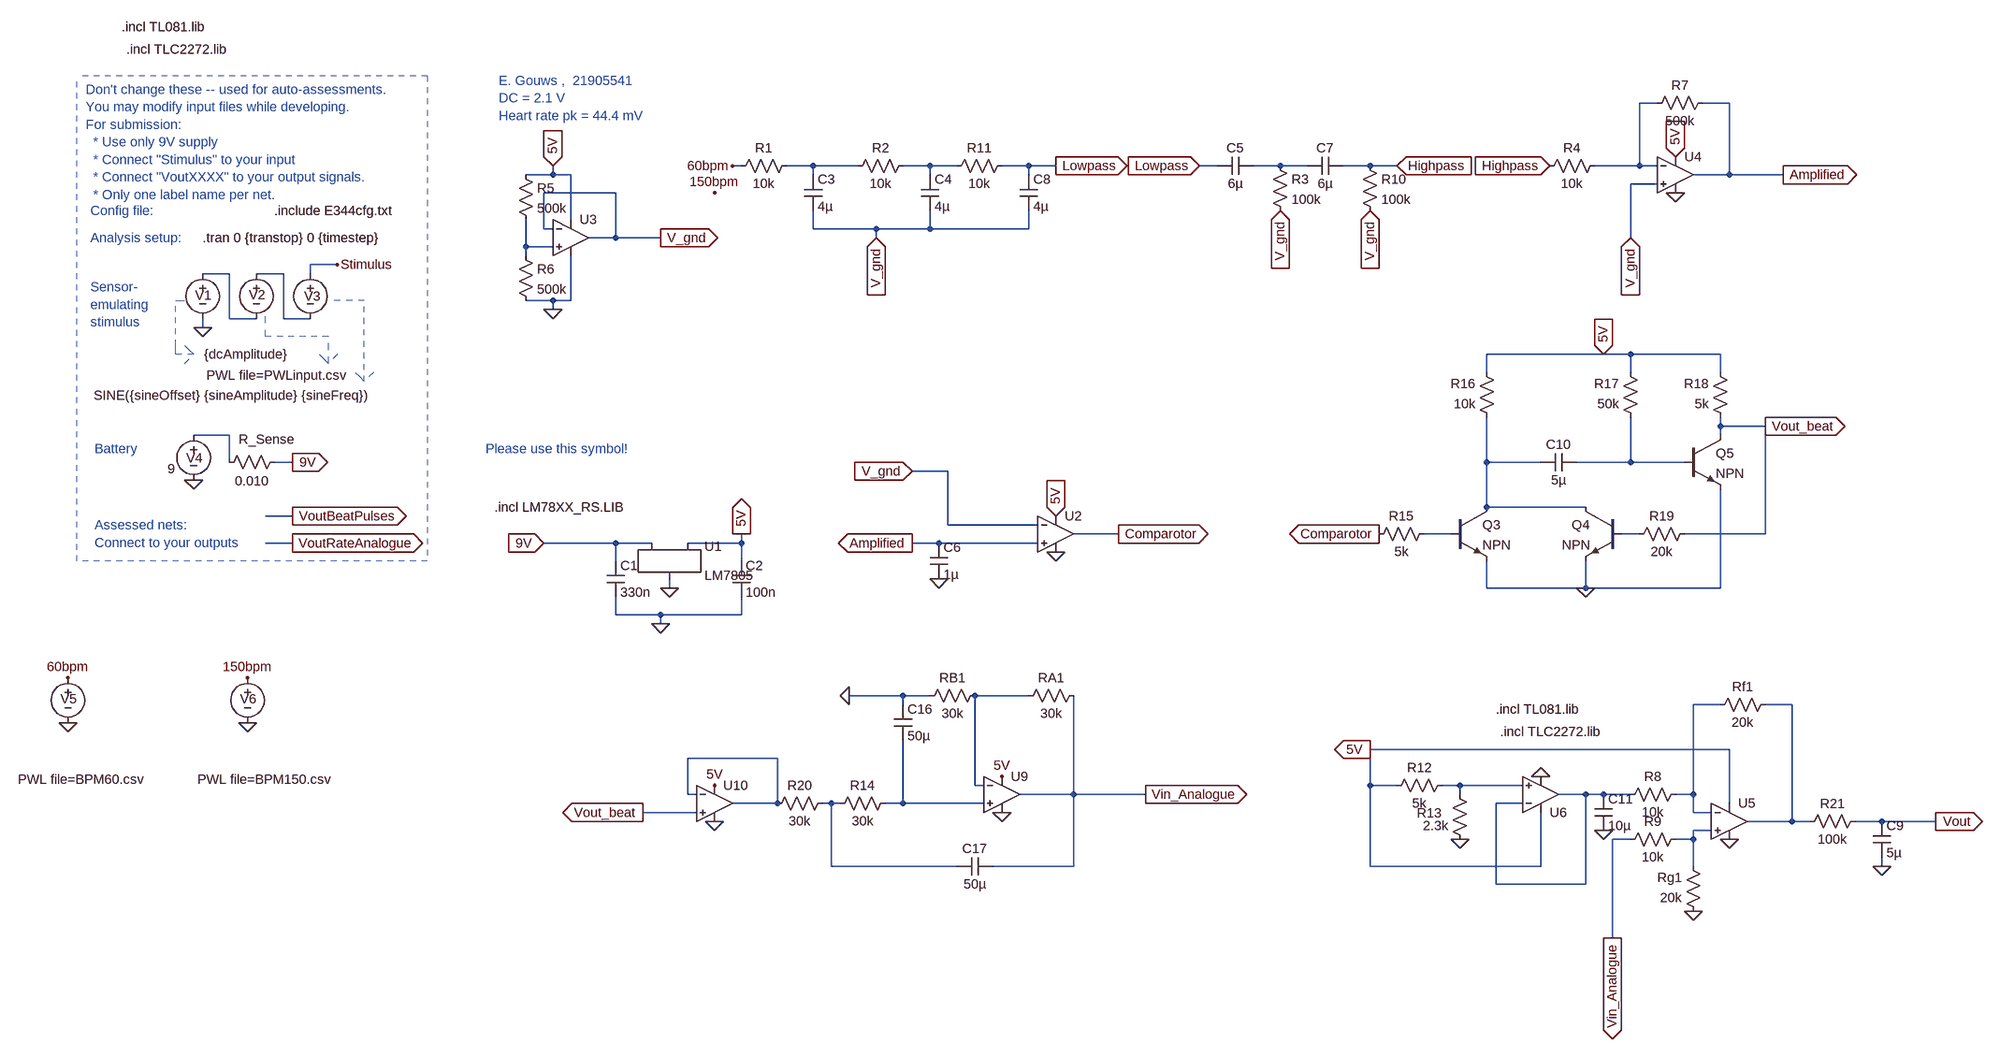
[diagram p0: schematic 21905541.asc]
21905541.asc, the LTspice schematic file:
Version 4
SHEET 1 2032 680
WIRE 512 -1360 480 -1360
WIRE 640 -1360 592 -1360
WIRE -1120 -1248 -1136 -1248
WIRE -992 -1248 -1040 -1248
WIRE -912 -1248 -992 -1248
WIRE -784 -1248 -832 -1248
WIRE -736 -1248 -784 -1248
WIRE -608 -1248 -656 -1248
WIRE -560 -1248 -608 -1248
WIRE -272 -1248 -304 -1248
WIRE -160 -1248 -208 -1248
WIRE -112 -1248 -160 -1248
WIRE 0 -1248 -48 -1248
WIRE 48 -1248 0 -1248
WIRE 480 -1248 480 -1360
WIRE 480 -1248 400 -1248
WIRE 512 -1248 480 -1248
WIRE -1456 -1232 -1456 -1248
WIRE -1456 -1232 -1504 -1232
WIRE -1424 -1232 -1456 -1232
WIRE -992 -1232 -992 -1248
WIRE -784 -1232 -784 -1248
WIRE -608 -1232 -608 -1248
WIRE 640 -1232 640 -1360
WIRE 640 -1232 576 -1232
WIRE 736 -1232 640 -1232
WIRE 512 -1216 464 -1216
WIRE -1344 -1200 -1472 -1200
WIRE -1424 -1152 -1424 -1232
WIRE -1472 -1136 -1472 -1200
WIRE -1456 -1136 -1472 -1136
WIRE -992 -1136 -992 -1168
WIRE -880 -1136 -992 -1136
WIRE -784 -1136 -784 -1168
WIRE -784 -1136 -880 -1136
WIRE -608 -1136 -608 -1168
WIRE -608 -1136 -784 -1136
WIRE -1344 -1120 -1344 -1200
WIRE -1344 -1120 -1392 -1120
WIRE -1264 -1120 -1344 -1120
WIRE -880 -1120 -880 -1136
WIRE 464 -1120 464 -1216
WIRE -1504 -1104 -1504 -1152
WIRE -1456 -1104 -1504 -1104
WIRE -1504 -1088 -1504 -1104
WIRE -1840 -1072 -1888 -1072
WIRE -2032 -1056 -2080 -1056
WIRE -1936 -1056 -1984 -1056
WIRE -1888 -1056 -1888 -1072
WIRE -1456 -1008 -1504 -1008
WIRE -1424 -1008 -1424 -1088
WIRE -1424 -1008 -1456 -1008
WIRE -1456 -992 -1456 -1008
WIRE -2032 -976 -2032 -1056
WIRE -1984 -976 -2032 -976
WIRE -1936 -976 -1936 -1056
WIRE -1888 -976 -1936 -976
WIRE -2080 -960 -2080 -976
WIRE 416 -912 208 -912
WIRE 464 -912 416 -912
WIRE 624 -912 464 -912
WIRE 208 -880 208 -912
WIRE 464 -880 464 -912
WIRE 624 -880 624 -912
WIRE 624 -784 624 -800
WIRE 704 -784 624 -784
WIRE -2032 -768 -2096 -768
WIRE 624 -768 624 -784
WIRE -2032 -720 -2032 -768
WIRE -1920 -720 -1952 -720
WIRE 208 -720 208 -800
WIRE 304 -720 208 -720
WIRE 464 -720 464 -800
WIRE 464 -720 368 -720
WIRE 560 -720 464 -720
WIRE -752 -704 -816 -704
WIRE 208 -640 208 -720
WIRE 384 -640 208 -640
WIRE -1920 -624 -1968 -624
WIRE -752 -608 -752 -704
WIRE -592 -608 -752 -608
WIRE -448 -592 -528 -592
WIRE 144 -592 96 -592
WIRE 480 -592 448 -592
WIRE 704 -592 704 -784
WIRE 704 -592 560 -592
WIRE -1920 -576 -1968 -576
WIRE -1344 -576 -1472 -576
WIRE -1280 -576 -1344 -576
WIRE -1120 -576 -1120 -592
WIRE -1120 -576 -1216 -576
WIRE -768 -576 -816 -576
WIRE -592 -576 -768 -576
WIRE -1344 -544 -1344 -576
WIRE -1120 -544 -1120 -576
WIRE -1248 -496 -1248 -512
WIRE 208 -496 208 -544
WIRE 384 -496 384 -544
WIRE 384 -496 208 -496
WIRE 624 -496 624 -672
WIRE 624 -496 384 -496
WIRE -1344 -448 -1344 -480
WIRE -1264 -448 -1344 -448
WIRE -1120 -448 -1120 -480
WIRE -1120 -448 -1264 -448
WIRE -1264 -432 -1264 -448
WIRE -832 -304 -928 -304
WIRE -784 -304 -832 -304
WIRE -608 -304 -704 -304
WIRE -832 -288 -832 -304
WIRE 624 -288 576 -288
WIRE 752 -288 704 -288
WIRE 640 -208 0 -208
WIRE -1056 -192 -1216 -192
WIRE -704 -144 -704 -304
WIRE -688 -144 -704 -144
WIRE 0 -144 0 -208
WIRE 48 -144 0 -144
WIRE 160 -144 128 -144
WIRE 272 -144 160 -144
WIRE -1216 -128 -1216 -192
WIRE -1200 -128 -1216 -128
WIRE -528 -128 -528 -304
WIRE -528 -128 -624 -128
WIRE -400 -128 -528 -128
WIRE 160 -128 160 -144
WIRE 384 -128 336 -128
WIRE 416 -128 384 -128
WIRE 464 -128 416 -128
WIRE 576 -128 576 -288
WIRE 576 -128 544 -128
WIRE -1056 -112 -1056 -192
WIRE -1056 -112 -1136 -112
WIRE -960 -112 -976 -112
WIRE -944 -112 -960 -112
WIRE -832 -112 -832 -224
WIRE -832 -112 -864 -112
WIRE -688 -112 -832 -112
WIRE 272 -112 224 -112
WIRE 640 -112 640 -208
WIRE -1200 -96 -1296 -96
WIRE 576 -96 576 -128
WIRE 608 -96 576 -96
WIRE 752 -80 752 -288
WIRE 752 -80 672 -80
WIRE 784 -80 752 -80
WIRE 912 -80 864 -80
WIRE 1008 -80 912 -80
WIRE 608 -64 576 -64
WIRE 1008 -64 1008 -80
WIRE 464 -48 432 -48
WIRE 576 -48 576 -64
WIRE 576 -48 544 -48
WIRE -960 0 -960 -112
WIRE -736 0 -960 0
WIRE -528 0 -528 -128
WIRE -528 0 -672 0
WIRE 0 0 0 -144
WIRE 304 0 304 -96
WIRE 304 0 0 0
WIRE 576 0 576 -48
WIRE 912 0 912 -16
WIRE 224 32 224 -112
WIRE 384 32 384 -128
WIRE 384 32 224 32
WIRE 432 128 432 -48
FLAG -2080 -960 0
FLAG -1840 -1072 Stimulus
FLAG -1920 -720 9V
IOPIN -1920 -720 Out
FLAG -2096 -688 0
FLAG -1920 -624 VoutBeatPulses
IOPIN -1920 -624 Out
FLAG -1920 -576 VoutRateAnalogue
IOPIN -1920 -576 Out
FLAG -1248 -496 0
FLAG -1264 -432 0
FLAG -1472 -576 9V
IOPIN -1472 -576 In
FLAG -1120 -592 5V
IOPIN -1120 -592 Out
FLAG -1456 -992 0
FLAG -1456 -1248 5V
IOPIN -1456 -1248 In
FLAG -1264 -1120 V_gnd
IOPIN -1264 -1120 Out
FLAG -560 -1248 Lowpass
IOPIN -560 -1248 Out
FLAG -304 -1248 Lowpass
IOPIN -304 -1248 In
FLAG 48 -1248 Highpass
IOPIN 48 -1248 In
FLAG 736 -1232 Amplified
IOPIN 736 -1232 Out
FLAG 464 -1120 V_gnd
IOPIN 464 -1120 In
FLAG 544 -1264 5V
IOPIN 544 -1264 In
FLAG 320 -1248 Highpass
IOPIN 320 -1248 In
FLAG 544 -1200 0
FLAG -160 -1168 V_gnd
IOPIN -160 -1168 In
FLAG -880 -1120 V_gnd
IOPIN -880 -1120 In
FLAG -816 -576 Amplified
IOPIN -816 -576 Out
FLAG -448 -592 Comparotor
IOPIN -448 -592 Out
FLAG -560 -624 5V
IOPIN -560 -624 In
FLAG -560 -560 0
FLAG -816 -704 V_gnd
IOPIN -816 -704 In
FLAG -768 -512 0
FLAG 384 -496 0
FLAG 416 -912 5V
IOPIN 416 -912 In
FLAG 16 -592 Comparotor
IOPIN 16 -592 Out
FLAG -2320 -256 0
FLAG -2000 -256 0
FLAG -2320 -336 60bpm
FLAG -2000 -336 150bpm
FLAG 0 -1168 V_gnd
IOPIN 0 -1168 In
FLAG 640 -48 0
FLAG 576 80 0
FLAG 160 -48 0
FLAG 304 -160 0
FLAG 1008 -80 Vout
IOPIN 1008 -80 Out
FLAG 0 -208 5V
IOPIN 0 -208 Out
FLAG 416 -64 0
FLAG 704 -784 Vout_beat
IOPIN 704 -784 Out
FLAG -656 -96 0
FLAG -928 -304 0
FLAG -656 -160 5V
FLAG -1168 -80 0
FLAG -1296 -96 Vout_beat
IOPIN -1296 -96 Out
FLAG -1168 -144 5V
FLAG -400 -128 Vin_Analogue
IOPIN -400 -128 Out
FLAG 432 128 Vin_Analogue
IOPIN 432 128 Out
FLAG -1168 -1200 150bpm
FLAG -1136 -1248 60bpm
FLAG 912 0 0
SYMBOL voltage -1984 -1072 R0
WINDOW 123 0 0 Left 0
WINDOW 39 0 0 Left 0
WINDOW 3 -89 197 Left 2
WINDOW 0 -13 54 Left 2
SYMATTR Value PWL file=PWLinput.csv
SYMATTR InstName V2
SYMBOL voltage -1888 -1072 R0
WINDOW 123 24 44 Left 2
WINDOW 39 0 0 Left 0
WINDOW 3 -386 233 Left 2
WINDOW 0 -11 56 Left 2
SYMATTR Value SINE({sineOffset} {sineAmplitude} {sineFreq})
SYMATTR InstName V3
SYMBOL voltage -2080 -1072 R0
WINDOW 123 0 0 Left 0
WINDOW 39 0 0 Left 0
WINDOW 3 3 160 Left 2
WINDOW 0 -13 55 Left 2
SYMATTR Value {dcAmplitude}
SYMATTR InstName V1
SYMBOL voltage -2096 -784 R0
WINDOW 123 24 44 Left 2
WINDOW 39 0 0 Left 0
WINDOW 3 -46 76 Left 2
WINDOW 0 -13 57 Left 2
SYMATTR Value 9
SYMATTR InstName V4
SYMBOL res -1936 -736 R90
WINDOW 0 -9 30 VBottom 2
WINDOW 3 34 56 VTop 2
SYMATTR InstName R_Sense
SYMATTR Value 0.010
SYMBOL LM7805 -1248 -560 R0
SYMATTR InstName U1
SYMBOL cap -1360 -544 R0
SYMATTR InstName C1
SYMATTR Value 330n
SYMBOL cap -1136 -544 R0
SYMATTR InstName C2
SYMATTR Value 100n
SYMBOL res -1520 -1248 R0
SYMATTR InstName R5
SYMATTR Value 500k
SYMBOL res -1520 -1104 R0
SYMATTR InstName R6
SYMATTR Value 500k
SYMBOL res -1024 -1264 R90
WINDOW 0 0 56 VBottom 2
WINDOW 3 32 56 VTop 2
SYMATTR InstName R1
SYMATTR Value 10k
SYMBOL res -816 -1264 R90
WINDOW 0 0 56 VBottom 2
WINDOW 3 32 56 VTop 2
SYMATTR InstName R2
SYMATTR Value 10k
SYMBOL cap -1008 -1232 R0
SYMATTR InstName C3
SYMATTR Value 4µ
SYMBOL cap -800 -1232 R0
SYMATTR InstName C4
SYMATTR Value 4µ
SYMBOL cap -208 -1264 R90
WINDOW 0 0 32 VBottom 2
WINDOW 3 32 32 VTop 2
SYMATTR InstName C5
SYMATTR Value 6µ
SYMBOL res -176 -1264 R0
SYMATTR InstName R3
SYMATTR Value 100k
SYMBOL res 416 -1264 R90
WINDOW 0 0 56 VBottom 2
WINDOW 3 32 56 VTop 2
SYMATTR InstName R4
SYMATTR Value 10k
SYMBOL res 608 -1376 R90
WINDOW 0 0 56 VBottom 2
WINDOW 3 32 56 VTop 2
SYMATTR InstName R7
SYMATTR Value 500k
SYMBOL cap -784 -576 R0
SYMATTR InstName C6
SYMATTR Value 1µ
SYMBOL OpAmps\\UniversalOpamp2 -560 -592 R0
SYMATTR InstName U2
SYMBOL OpAmps\\UniversalOpamp2 544 -1232 R0
SYMATTR InstName U4
SYMBOL OpAmps\\UniversalOpamp2 -1424 -1120 R0
SYMATTR InstName U3
SYMBOL npn 144 -640 R0
SYMATTR InstName Q3
SYMBOL npn 448 -640 M0
SYMATTR InstName Q4
SYMBOL npn 560 -768 R0
SYMATTR InstName Q5
SYMBOL res 112 -608 R90
WINDOW 0 0 56 VBottom 2
WINDOW 3 32 56 VTop 2
SYMATTR InstName R15
SYMATTR Value 5k
SYMBOL res 224 -784 R180
WINDOW 0 36 76 Left 2
WINDOW 3 36 40 Left 2
SYMATTR InstName R16
SYMATTR Value 10k
SYMBOL res 480 -784 R180
WINDOW 0 36 76 Left 2
WINDOW 3 36 40 Left 2
SYMATTR InstName R17
SYMATTR Value 50k
SYMBOL res 640 -784 R180
WINDOW 0 36 76 Left 2
WINDOW 3 36 40 Left 2
SYMATTR InstName R18
SYMATTR Value 5k
SYMBOL cap 368 -736 R90
WINDOW 0 0 32 VBottom 2
WINDOW 3 32 32 VTop 2
SYMATTR InstName C10
SYMATTR Value 5µ
SYMBOL res 576 -608 R90
WINDOW 0 0 56 VBottom 2
WINDOW 3 32 56 VTop 2
SYMATTR InstName R19
SYMATTR Value 20k
SYMBOL voltage -2320 -352 R0
WINDOW 123 0 0 Left 0
WINDOW 39 0 0 Left 0
WINDOW 3 -89 197 Left 2
WINDOW 0 -13 54 Left 2
SYMATTR Value PWL file=BPM60.csv
SYMATTR InstName V5
SYMBOL voltage -2000 -352 R0
WINDOW 123 0 0 Left 0
WINDOW 39 0 0 Left 0
WINDOW 3 -89 197 Left 2
WINDOW 0 -13 54 Left 2
SYMATTR Value PWL file=BPM150.csv
SYMATTR InstName V6
SYMBOL cap -48 -1264 R90
WINDOW 0 0 32 VBottom 2
WINDOW 3 32 32 VTop 2
SYMATTR InstName C7
SYMATTR Value 6µ
SYMBOL res -16 -1264 R0
SYMATTR InstName R10
SYMATTR Value 100k
SYMBOL res -640 -1264 R90
WINDOW 0 0 56 VBottom 2
WINDOW 3 32 56 VTop 2
SYMATTR InstName R11
SYMATTR Value 10k
SYMBOL cap -624 -1232 R0
SYMATTR InstName C8
SYMATTR Value 4µ
SYMBOL res 560 -144 R90
WINDOW 0 0 56 VBottom 2
WINDOW 3 32 56 VTop 2
SYMATTR InstName R8
SYMATTR Value 10k
SYMBOL res 560 -64 R90
WINDOW 0 0 56 VBottom 2
WINDOW 3 32 56 VTop 2
SYMATTR InstName R9
SYMATTR Value 10k
SYMBOL res 592 96 R180
WINDOW 0 36 76 Left 2
WINDOW 3 36 40 Left 2
SYMATTR InstName Rg1
SYMATTR Value 20k
SYMBOL res 608 -272 R270
WINDOW 0 32 56 VTop 2
WINDOW 3 0 56 VBottom 2
SYMATTR InstName Rf1
SYMATTR Value 20k
SYMBOL res 144 -160 R90
WINDOW 0 0 56 VBottom 2
WINDOW 3 32 56 VTop 2
SYMATTR InstName R12
SYMATTR Value 5k
SYMBOL res 176 -32 R180
WINDOW 0 48 63 Left 2
WINDOW 3 36 40 Left 2
SYMATTR InstName R13
SYMATTR Value 2.3k
SYMBOL cap 400 -128 R0
SYMATTR InstName C11
SYMATTR Value 10µ
SYMBOL OpAmps\\UniversalOpamp2 640 -80 R0
SYMATTR InstName U5
SYMBOL OpAmps\\UniversalOpamp2 304 -128 M180
SYMATTR InstName U6
SYMBOL cap -848 -288 R0
SYMATTR InstName C16
SYMATTR Value 50µ
SYMBOL cap -672 -16 R90
WINDOW 0 0 32 VBottom 2
WINDOW 3 32 32 VTop 2
SYMATTR InstName C17
SYMATTR Value 50µ
SYMBOL res -800 -288 R270
WINDOW 0 32 56 VTop 2
WINDOW 3 0 56 VBottom 2
SYMATTR InstName RB1
SYMATTR Value 30k
SYMBOL res -512 -320 R90
WINDOW 0 0 56 VBottom 2
WINDOW 3 32 56 VTop 2
SYMATTR InstName RA1
SYMATTR Value 30k
SYMBOL res -848 -128 R90
WINDOW 0 0 56 VBottom 2
WINDOW 3 32 56 VTop 2
SYMATTR InstName R14
SYMATTR Value 30k
SYMBOL res -960 -128 R90
WINDOW 0 0 56 VBottom 2
WINDOW 3 32 56 VTop 2
SYMATTR InstName R20
SYMATTR Value 30k
SYMBOL Opamps\\UniversalOpamp2 -656 -128 R0
SYMATTR InstName U9
SYMBOL Opamps\\UniversalOpamp2 -1168 -112 R0
SYMATTR InstName U10
SYMBOL cap 896 -80 R0
SYMATTR InstName C9
SYMATTR Value 5µ
SYMBOL res 880 -96 R90
WINDOW 0 0 56 VBottom 2
WINDOW 3 32 56 VTop 2
SYMATTR InstName R21
SYMATTR Value 100k
TEXT -2080 -1120 Left 2 !.tran 0 {transtop} 0 {timestep}
TEXT -1952 -1168 Left 2 !.include E344cfg.txt
TEXT -2288 -1384 Left 2 ;Don't change these -- used for auto-assessments.\nYou may modify input files while developing.\nFor submission: \n  * Use only 9V supply \n  * Connect "Stimulus" to your input\n  * Connect "VoutXXXX" to your output signals.\n  * Only one label name per net.
TEXT -2280 -1168 Left 2 ;Config file:
TEXT -2280 -1120 Left 2 ;Analysis setup:
TEXT -2272 -744 Left 2 ;Battery
TEXT -2280 -1032 Left 2 ;Sensor-\nemulating \nstimulus
TEXT -2272 -608 Left 2 ;Assessed nets:\nConnect to your outputs
TEXT -1552 -1400 Left 2 ;E. Gouws ,  21905541\nDC = 2.1 V\nHeart rate pk = 44.4 mV
TEXT -1576 -744 Left 2 ;Please use this symbol!
TEXT -1560 -640 Left 2 !.incl LM78XX_RS.LIB
TEXT -2224 -1496 Left 2 !.incl TL081.lib
TEXT -2216 -1456 Left 2 !.incl TLC2272.lib
TEXT 224 -280 Left 2 !.incl TL081.lib
TEXT 232 -240 Left 2 !.incl TLC2272.lib
LINE Normal -1792 -1008 -1856 -1008 2
LINE Normal -1792 -864 -1792 -1008 2
LINE Normal -1808 -880 -1792 -864 2
LINE Normal -1792 -864 -1808 -880 2
LINE Normal -1776 -880 -1792 -864 2
LINE Normal -2128 -1008 -2112 -1008 2
LINE Normal -2128 -928 -2128 -1008 2
LINE Normal -2128 -912 -2128 -928 2
LINE Normal -2096 -912 -2128 -912 2
LINE Normal -2112 -928 -2096 -912 2
LINE Normal -2096 -912 -2112 -928 2
LINE Normal -2112 -896 -2096 -912 2
LINE Normal -1968 -944 -1968 -992 2
LINE Normal -1856 -944 -1968 -944 2
LINE Normal -1856 -896 -1856 -944 2
LINE Normal -1872 -912 -1856 -896 2
LINE Normal -1856 -896 -1872 -912 2
LINE Normal -1840 -912 -1856 -896 2
LINE Normal -2304 -544 -2304 -1408 1
LINE Normal -1680 -1408 -1680 -544 1
LINE Normal -1680 -544 -2304 -544 1
LINE Normal -1680 -1408 -2304 -1408 1

The netlist it stands for:
* 21905541.asc
V2 N007 N006 PWL file=PWLinput.csv
V3 Stimulus N007 SINE({sineOffset} {sineAmplitude} {sineFreq})
V1 N006 0 {dcAmplitude}
V4 N008 0 9
R_Sense 9V N008 0.010
XU1 9V 0 5V LM7805
C1 9V 0 330n
C2 5V 0 100n
R5 5V N005 500k
R6 N005 0 500k
R1 N002 60bpm 10k
R2 N003 N002 10k
C3 N002 V_gnd 4µ
C4 N003 V_gnd 4µ
C5 N004 Lowpass 6µ
R3 N004 V_gnd 100k
R4 N001 Highpass 10k
R7 Amplified N001 500k
C6 Amplified 0 1µ
XU2 Amplified V_gnd 5V 0 Comparotor level.2 Avol=1Meg GBW=10Meg Slew=10Meg ilimit=25m rail=0 Vos=0 phimargin=45 en=0 enk=0 in=0 ink=0 Rin=500Meg  ; pins IN+ IN- V+ V- OUT
XU4 V_gnd N001 5V 0 Amplified level.2 Avol=1Meg GBW=10Meg Slew=10Meg ilimit=25m rail=0 Vos=0 phimargin=45 en=0 enk=0 in=0 ink=0 Rin=500Meg  ; pins IN+ IN- V+ V- OUT
XU3 N005 V_gnd 5V 0 V_gnd level.2 Avol=1Meg GBW=10Meg Slew=10Meg ilimit=25m rail=0 Vos=0 phimargin=45 en=0 enk=0 in=0 ink=0 Rin=500Meg  ; pins IN+ IN- V+ V- OUT
Q3 N009 N011 0 0 NPN
Q4 N009 N012 0 0 NPN
Q5 Vout_beat N010 0 0 NPN
R15 N011 Comparotor 5k
R16 N009 5V 10k
R17 N010 5V 50k
R18 Vout_beat 5V 5k
C10 N010 N009 5µ
R19 Vout_beat N012 20k
V5 60bpm 0 PWL file=BPM60.csv
V6 150bpm 0 PWL file=BPM150.csv
C7 Highpass N004 6µ
R10 Highpass V_gnd 100k
R11 Lowpass N003 10k
C8 Lowpass V_gnd 4µ
R8 N014 N018 10k
R9 N021 Vin_Analogue 10k
Rg1 0 N021 20k
Rf1 N014 N015 20k
R12 N017 5V 5k
R13 0 N017 2.3k
C11 N018 0 10µ
XU5 N021 N014 5V 0 N015 level.2 Avol=1Meg GBW=10Meg Slew=10Meg ilimit=25m rail=0 Vos=0 phimargin=45 en=0 enk=0 in=0 ink=0 Rin=500Meg  ; pins IN+ IN- V+ V- OUT
XU6 N017 N018 5V 0 N018 level.2 Avol=1Meg GBW=10Meg Slew=10Meg ilimit=25m rail=0 Vos=0 phimargin=45 en=0 enk=0 in=0 ink=0 Rin=500Meg  ; pins IN+ IN- V+ V- OUT
C16 0 N020 50µ
C17 Vin_Analogue N019 50µ
RB1 0 N013 30k
RA1 Vin_Analogue N013 30k
R14 N020 N019 30k
R20 N019 N016 30k
XU9 N020 N013 5V 0 Vin_Analogue level.2 Avol=1Meg GBW=10Meg Slew=10Meg ilimit=25m rail=0 Vos=0 phimargin=45 en=0 enk=0 in=0 ink=0 Rin=500Meg  ; pins IN+ IN- V+ V- OUT
XU10 Vout_beat N016 5V 0 N016 level.2 Avol=1Meg GBW=10Meg Slew=10Meg ilimit=25m rail=0 Vos=0 phimargin=45 en=0 enk=0 in=0 ink=0 Rin=500Meg  ; pins IN+ IN- V+ V- OUT
C9 Vout 0 5µ
R21 Vout N015 100k
.model NPN NPN
.model PNP PNP
.lib standard.bjt
.tran 0 {transtop} 0 {timestep}
.include E344cfg.txt
* Don't change these -- used for auto-assessments.
* You may modify input files while developing.
* For submission:
*   * Use only 9V supply
*   * Connect "Stimulus" to your input
*   * Connect "VoutXXXX" to your output signals.
*   * Only one label name per net.
* Config file:
* Analysis setup:
* Battery
* Sensor-
* emulating
* stimulus
* Assessed nets:
* Connect to your outputs
* E. Gouws ,  21905541
* DC = 2.1 V
* Heart rate pk = 44.4 mV
* Please use this symbol!
.incl LM78XX_RS.LIB
.incl TL081.lib
.incl TLC2272.lib
.incl TL081.lib
.incl TLC2272.lib
.lib UniversalOpamps2.sub
.backanno
.end